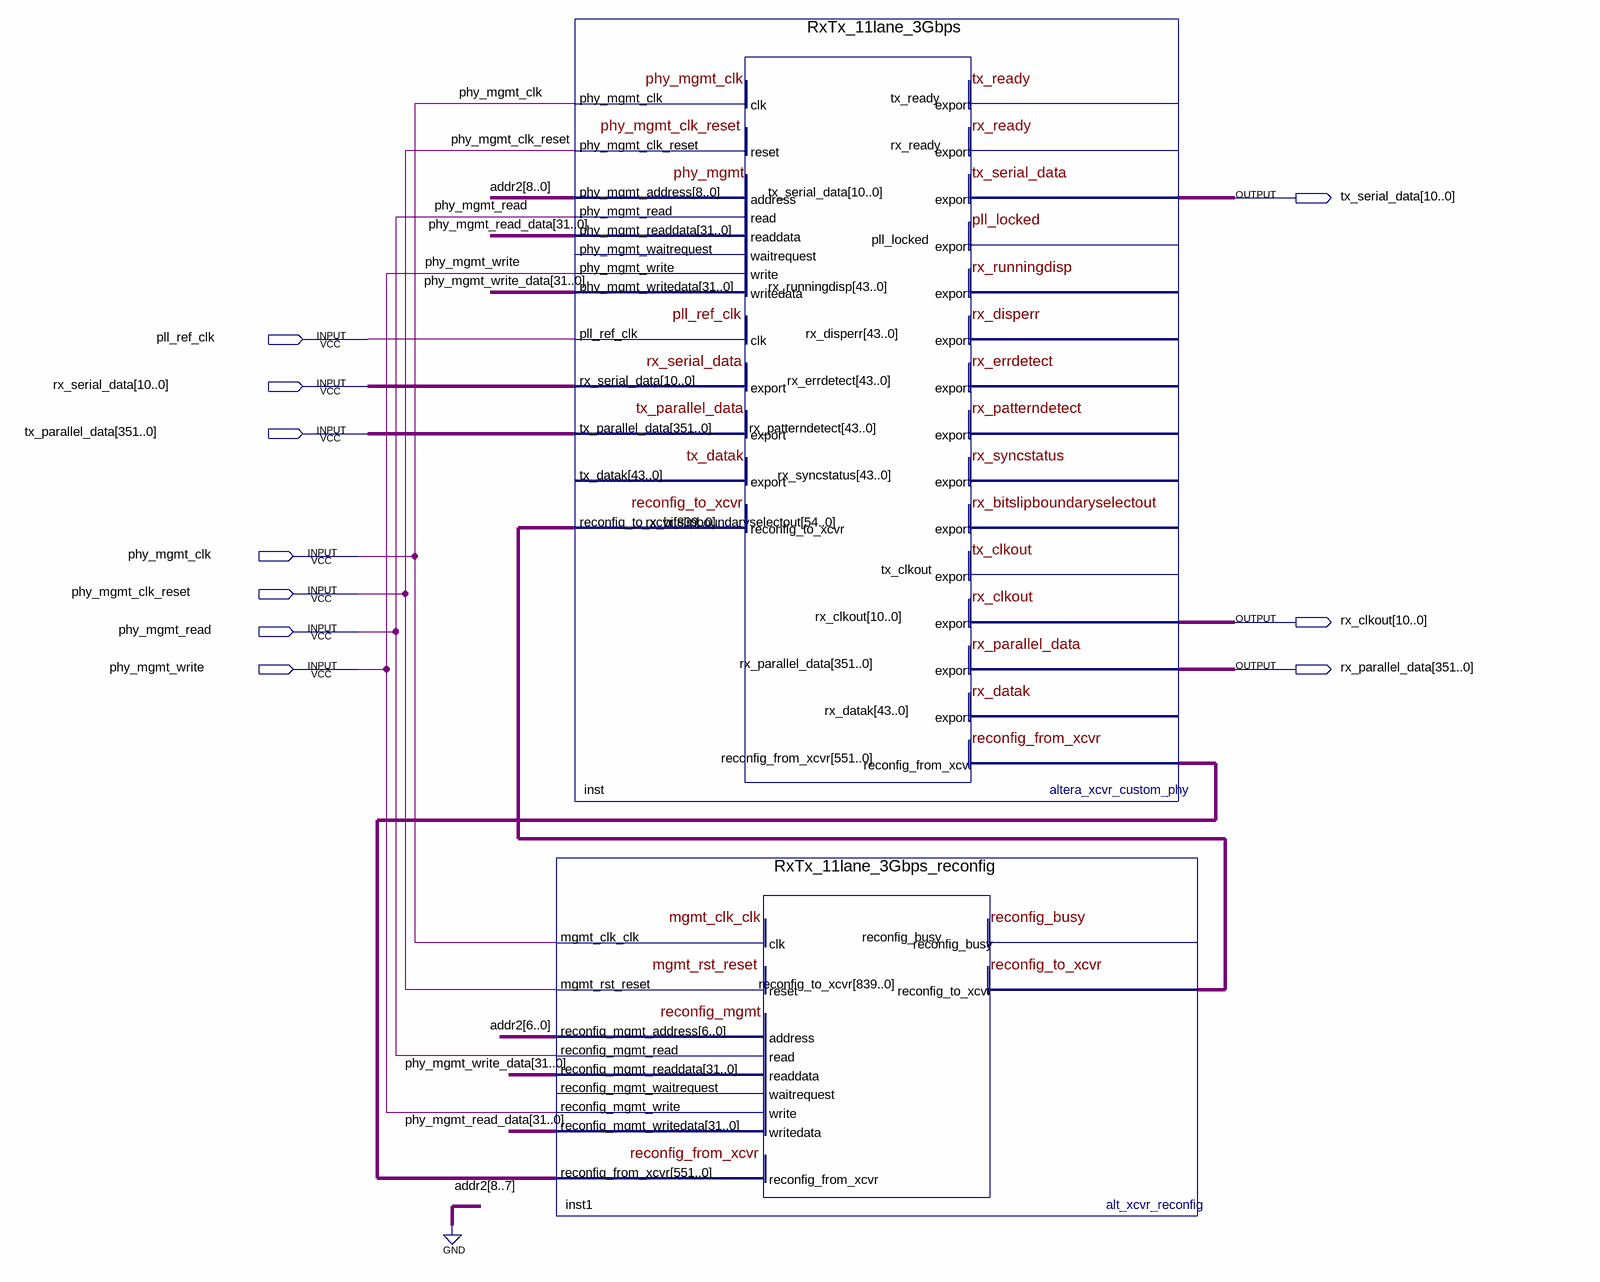
[diagram p0: schematic sheet]
// Quartus schematic RxTx_3Gbps_schematic.bdf as structural Verilog: 2 symbols, 10 pins
module RxTx_3Gbps_schematic (
  input  pll_ref_clk,
  input  [10:0] rx_serial_data,
  input  [351:0] tx_parallel_data,
  input  phy_mgmt_clk,
  input  phy_mgmt_clk_reset,
  input  phy_mgmt_read,
  input  phy_mgmt_write,
  output [10:0] tx_serial_data,
  output [10:0] rx_clkout,
  output [351:0] rx_parallel_data
);

  wire [6:0] addr2;
  wire [31:0] phy_mgmt_read_data, phy_mgmt_write_data;
  wire [551:0] inst_reconfig_from_xcvr;
  wire [839:0] inst1_reconfig_to_xcvr;

  RxTx_11lane_3Gbps inst (
    .phy_mgmt_clk(phy_mgmt_clk), .phy_mgmt_clk_reset(phy_mgmt_clk_reset), .phy_mgmt_address({2'b00, addr2}),
    .phy_mgmt_read(phy_mgmt_read), .phy_mgmt_write(phy_mgmt_write), .phy_mgmt_writedata(phy_mgmt_write_data),
    .pll_ref_clk(pll_ref_clk), .rx_serial_data(rx_serial_data), .tx_parallel_data(tx_parallel_data),
    .reconfig_to_xcvr(inst1_reconfig_to_xcvr), .phy_mgmt_readdata(phy_mgmt_read_data),
    .tx_serial_data(tx_serial_data), .rx_clkout(rx_clkout), .rx_parallel_data(rx_parallel_data),
    .reconfig_from_xcvr(inst_reconfig_from_xcvr));  // open: tx_datak, phy_mgmt_waitrequest, tx_ready, rx_ready, pll_locked, rx_runningdisp, rx_disperr, rx_errdetect, rx_patterndetect, rx_syncstatus, rx_bitslipboundaryselectout, tx_clkout, rx_datak
  RxTx_11lane_3Gbps_reconfig inst1 (
    .mgmt_clk_clk(phy_mgmt_clk), .mgmt_rst_reset(phy_mgmt_clk_reset), .reconfig_mgmt_address(addr2),
    .reconfig_mgmt_read(phy_mgmt_read), .reconfig_mgmt_write(phy_mgmt_write),
    .reconfig_mgmt_writedata(phy_mgmt_read_data), .reconfig_from_xcvr(inst_reconfig_from_xcvr),
    .reconfig_mgmt_readdata(phy_mgmt_write_data), .reconfig_to_xcvr(inst1_reconfig_to_xcvr));  // open: reconfig_busy, reconfig_mgmt_waitrequest
endmodule
